# EAGLE design baseboard (EAGLE 6.4)
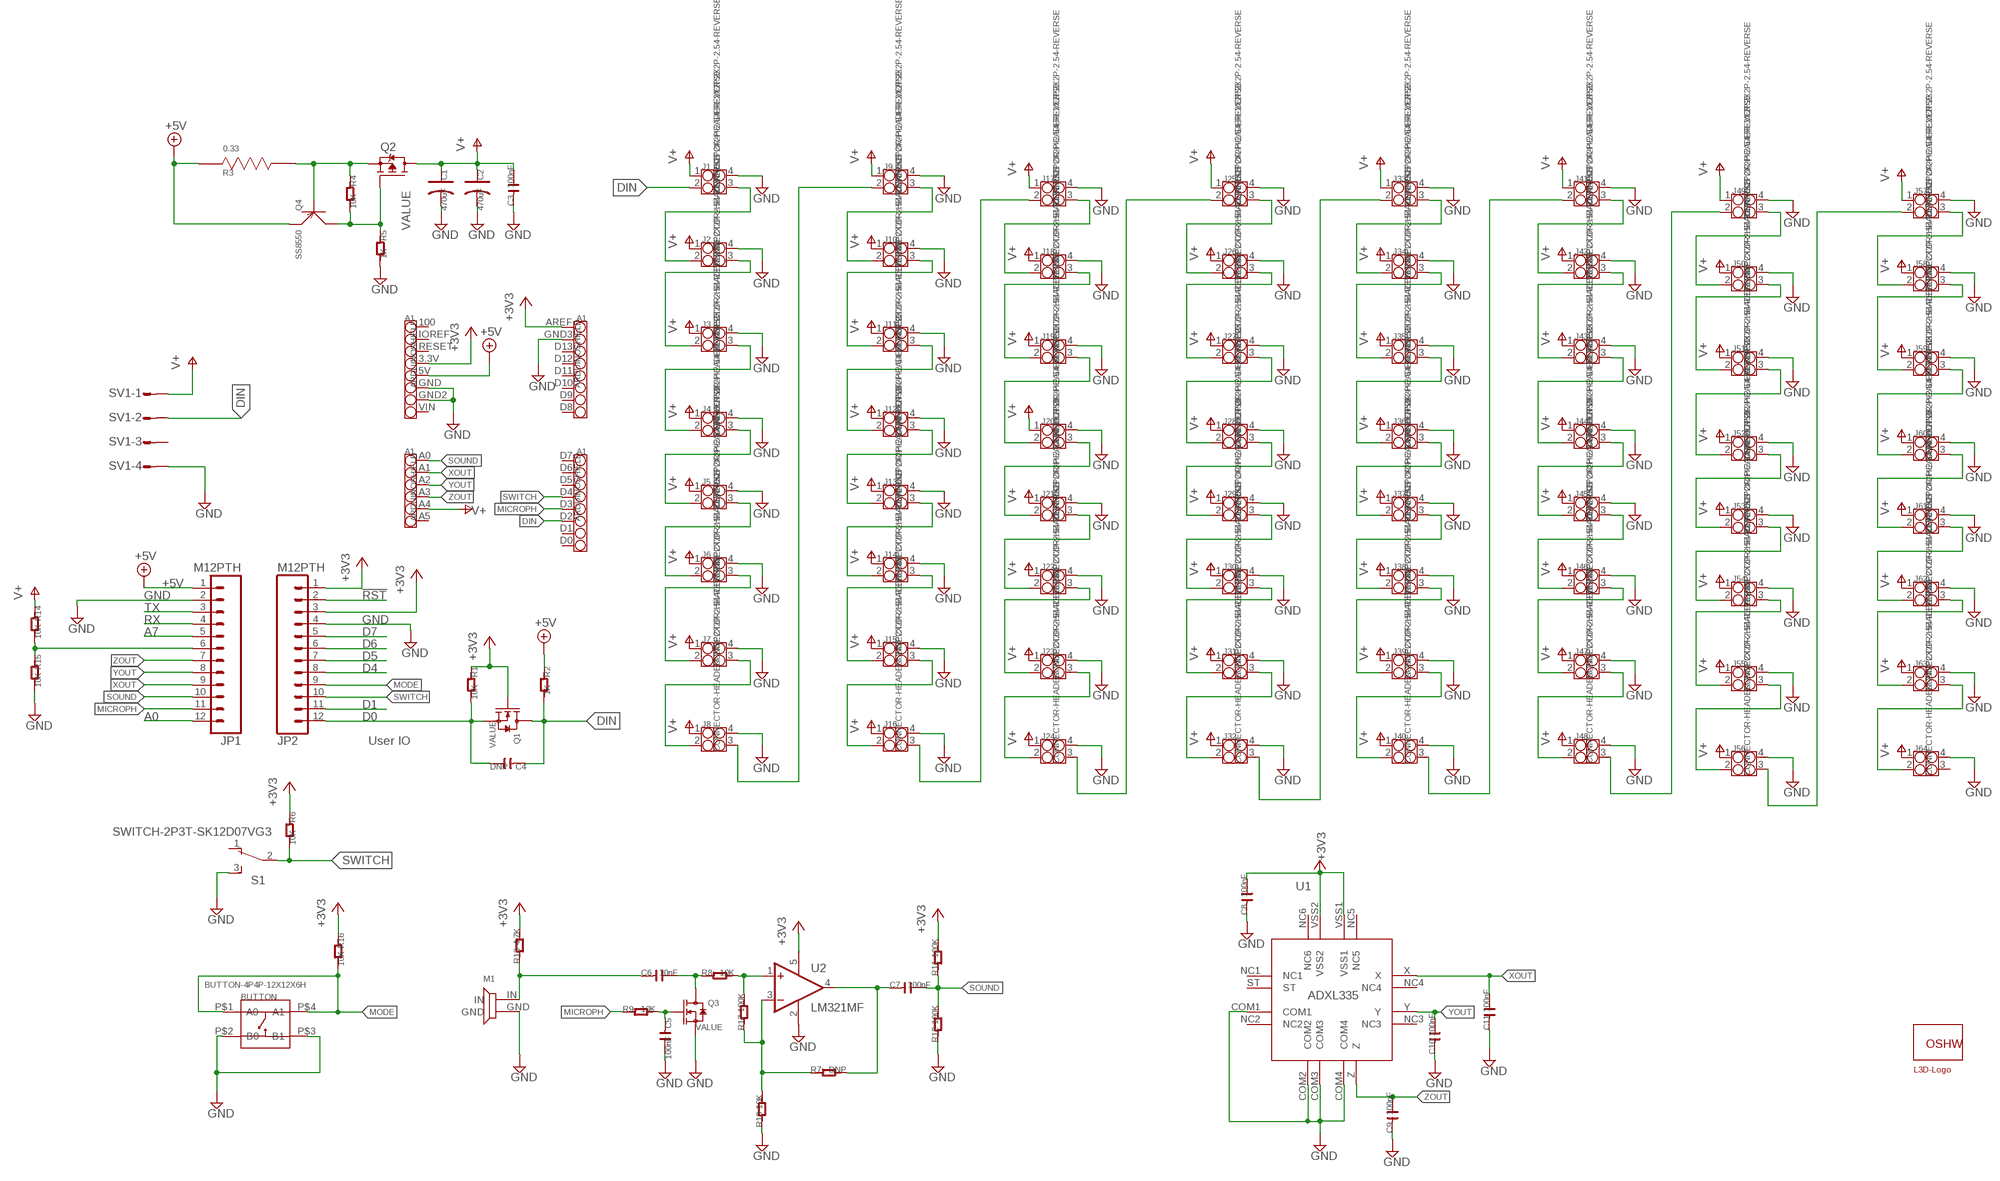
[diagram p0: schematic, sheet 1]

## Parts
A1  ARDUINOSHIELD  [ARDUINOSHIELD]
BUTTON  BUTTON-4P4P-12X12X6H  [4P-12X12X6H]
C1  470uF  C-POLAR  [CAPACITOR-E3-8]
C2  470uF  C-POLAR  [CAPACITOR-E3-8]
C3  100nF  C-0603  [C0603]
C4  DNP  C-0603  [C0603]
C5  100nF  C-0603  [C0603]
C6  10nF  C-0603  [C0603]
C7  100nF  C-0603  [C0603]
C8  100nF  C-0603  [C0603]
C9  100nF  C-0603  [C0603]
C10  100nF  C-0603  [C0603]
C11  100nF  C-0603  [C0603]
GOLD_ORB_SM1  OSHWLOGO_GOLD_ORB_MED  [OSHW1]
J1  CONNECTOR-HEADER-2X2P2X2P-2.54-REVERSE  [2X2P-2.54-REVERSE]
J2  CONNECTOR-HEADER-2X2P2X2P-2.54-REVERSE  [2X2P-2.54-REVERSE]
J3  CONNECTOR-HEADER-2X2P2X2P-2.54-REVERSE  [2X2P-2.54-REVERSE]
J4  CONNECTOR-HEADER-2X2P2X2P-2.54-REVERSE  [2X2P-2.54-REVERSE]
J5  CONNECTOR-HEADER-2X2P2X2P-2.54-REVERSE  [2X2P-2.54-REVERSE]
J6  CONNECTOR-HEADER-2X2P2X2P-2.54-REVERSE  [2X2P-2.54-REVERSE]
J7  CONNECTOR-HEADER-2X2P2X2P-2.54-REVERSE  [2X2P-2.54-REVERSE]
J8  CONNECTOR-HEADER-2X2P2X2P-2.54-REVERSE  [2X2P-2.54-REVERSE]
J9  CONNECTOR-HEADER-2X2P2X2P-2.54-REVERSE  [2X2P-2.54-REVERSE]
J10  CONNECTOR-HEADER-2X2P2X2P-2.54-REVERSE  [2X2P-2.54-REVERSE]
J11  CONNECTOR-HEADER-2X2P2X2P-2.54-REVERSE  [2X2P-2.54-REVERSE]
J12  CONNECTOR-HEADER-2X2P2X2P-2.54-REVERSE  [2X2P-2.54-REVERSE]
J13  CONNECTOR-HEADER-2X2P2X2P-2.54-REVERSE  [2X2P-2.54-REVERSE]
J14  CONNECTOR-HEADER-2X2P2X2P-2.54-REVERSE  [2X2P-2.54-REVERSE]
J15  CONNECTOR-HEADER-2X2P2X2P-2.54-REVERSE  [2X2P-2.54-REVERSE]
J16  CONNECTOR-HEADER-2X2P2X2P-2.54-REVERSE  [2X2P-2.54-REVERSE]
J17  CONNECTOR-HEADER-2X2P2X2P-2.54-REVERSE  [2X2P-2.54-REVERSE]
J18  CONNECTOR-HEADER-2X2P2X2P-2.54-REVERSE  [2X2P-2.54-REVERSE]
J19  CONNECTOR-HEADER-2X2P2X2P-2.54-REVERSE  [2X2P-2.54-REVERSE]
J20  CONNECTOR-HEADER-2X2P2X2P-2.54-REVERSE  [2X2P-2.54-REVERSE]
J21  CONNECTOR-HEADER-2X2P2X2P-2.54-REVERSE  [2X2P-2.54-REVERSE]
J22  CONNECTOR-HEADER-2X2P2X2P-2.54-REVERSE  [2X2P-2.54-REVERSE]
J23  CONNECTOR-HEADER-2X2P2X2P-2.54-REVERSE  [2X2P-2.54-REVERSE]
J24  CONNECTOR-HEADER-2X2P2X2P-2.54-REVERSE  [2X2P-2.54-REVERSE]
J25  CONNECTOR-HEADER-2X2P2X2P-2.54-REVERSE  [2X2P-2.54-REVERSE]
J26  CONNECTOR-HEADER-2X2P2X2P-2.54-REVERSE  [2X2P-2.54-REVERSE]
J27  CONNECTOR-HEADER-2X2P2X2P-2.54-REVERSE  [2X2P-2.54-REVERSE]
J28  CONNECTOR-HEADER-2X2P2X2P-2.54-REVERSE  [2X2P-2.54-REVERSE]
J29  CONNECTOR-HEADER-2X2P2X2P-2.54-REVERSE  [2X2P-2.54-REVERSE]
J30  CONNECTOR-HEADER-2X2P2X2P-2.54-REVERSE  [2X2P-2.54-REVERSE]
J31  CONNECTOR-HEADER-2X2P2X2P-2.54-REVERSE  [2X2P-2.54-REVERSE]
J32  CONNECTOR-HEADER-2X2P2X2P-2.54-REVERSE  [2X2P-2.54-REVERSE]
J33  CONNECTOR-HEADER-2X2P2X2P-2.54-REVERSE  [2X2P-2.54-REVERSE]
J34  CONNECTOR-HEADER-2X2P2X2P-2.54-REVERSE  [2X2P-2.54-REVERSE]
J35  CONNECTOR-HEADER-2X2P2X2P-2.54-REVERSE  [2X2P-2.54-REVERSE]
J36  CONNECTOR-HEADER-2X2P2X2P-2.54-REVERSE  [2X2P-2.54-REVERSE]
J37  CONNECTOR-HEADER-2X2P2X2P-2.54-REVERSE  [2X2P-2.54-REVERSE]
J38  CONNECTOR-HEADER-2X2P2X2P-2.54-REVERSE  [2X2P-2.54-REVERSE]
J39  CONNECTOR-HEADER-2X2P2X2P-2.54-REVERSE  [2X2P-2.54-REVERSE]
J40  CONNECTOR-HEADER-2X2P2X2P-2.54-REVERSE  [2X2P-2.54-REVERSE]
J41  CONNECTOR-HEADER-2X2P2X2P-2.54-REVERSE  [2X2P-2.54-REVERSE]
J42  CONNECTOR-HEADER-2X2P2X2P-2.54-REVERSE  [2X2P-2.54-REVERSE]
J43  CONNECTOR-HEADER-2X2P2X2P-2.54-REVERSE  [2X2P-2.54-REVERSE]
J44  CONNECTOR-HEADER-2X2P2X2P-2.54-REVERSE  [2X2P-2.54-REVERSE]
J45  CONNECTOR-HEADER-2X2P2X2P-2.54-REVERSE  [2X2P-2.54-REVERSE]
J46  CONNECTOR-HEADER-2X2P2X2P-2.54-REVERSE  [2X2P-2.54-REVERSE]
J47  CONNECTOR-HEADER-2X2P2X2P-2.54-REVERSE  [2X2P-2.54-REVERSE]
J48  CONNECTOR-HEADER-2X2P2X2P-2.54-REVERSE  [2X2P-2.54-REVERSE]
J49  CONNECTOR-HEADER-2X2P2X2P-2.54-REVERSE  [2X2P-2.54-REVERSE]
J50  CONNECTOR-HEADER-2X2P2X2P-2.54-REVERSE  [2X2P-2.54-REVERSE]
J51  CONNECTOR-HEADER-2X2P2X2P-2.54-REVERSE  [2X2P-2.54-REVERSE]
J52  CONNECTOR-HEADER-2X2P2X2P-2.54-REVERSE  [2X2P-2.54-REVERSE]
J53  CONNECTOR-HEADER-2X2P2X2P-2.54-REVERSE  [2X2P-2.54-REVERSE]
J54  CONNECTOR-HEADER-2X2P2X2P-2.54-REVERSE  [2X2P-2.54-REVERSE]
J55  CONNECTOR-HEADER-2X2P2X2P-2.54-REVERSE  [2X2P-2.54-REVERSE]
J56  CONNECTOR-HEADER-2X2P2X2P-2.54-REVERSE  [2X2P-2.54-REVERSE]
J57  CONNECTOR-HEADER-2X2P2X2P-2.54-REVERSE  [2X2P-2.54-REVERSE]
J58  CONNECTOR-HEADER-2X2P2X2P-2.54-REVERSE  [2X2P-2.54-REVERSE]
J59  CONNECTOR-HEADER-2X2P2X2P-2.54-REVERSE  [2X2P-2.54-REVERSE]
J60  CONNECTOR-HEADER-2X2P2X2P-2.54-REVERSE  [2X2P-2.54-REVERSE]
J61  CONNECTOR-HEADER-2X2P2X2P-2.54-REVERSE  [2X2P-2.54-REVERSE]
J62  CONNECTOR-HEADER-2X2P2X2P-2.54-REVERSE  [2X2P-2.54-REVERSE]
J63  CONNECTOR-HEADER-2X2P2X2P-2.54-REVERSE  [2X2P-2.54-REVERSE]
J64  CONNECTOR-HEADER-2X2P2X2P-2.54-REVERSE  [2X2P-2.54-REVERSE]
JP1  M12PTH  [1X12-SMALL-PADS]
JP2  M12PTH  [1X12-SMALL-PADS]
M1  MICROPHONE  [MICROPHONE]
Q1  2N7002  MOSFET-N-044020001  [SOT23]
Q2  FDD6637  FDD4141TO252  [TO252]
Q3  2N7002  MOSFET-N-044020001  [SOT23]
Q4  SS8550  TRANSISTOR-PNP-041003001  [SOT23]
R1  10K  R-0603  [R0603]
R2  1K  R-0603  [R0603]
R3  0.33  RESISTOR-3W-20MM  [RESISTOR-3W-20MM]
R4  10K  R-0603  [R0603]
R5  1K  R-0603  [R0603]
R6  10K  R-0603  [R0603]
R7  DNP  R-0603  [R0603]
R8  10K  R-0603  [R0603]
R9  10K  R-0603  [R0603]
R10  10K  R-0603  [R0603]
R11  100K  R-0603  [R0603]
R12  100K  R-0603  [R0603]
R13  4.7K  R-0603  [R0603]
R14  10K  R-0603  [R0603]
R15  10K  R-0603  [R0603]
R16  10K  R-0603  [R0603]
R17  100K  R-0603  [R0603]
S1  SWITCH-2P3T-SK12D07VG3  [SWITCH-2P3T-SK12D07VG3]
SV1  CON-S04P  [S04P]
U1  ADXL335  [ADXL335]
U2  LM321MF  [SOT23-5]
U$1  L3D-LOGOL3DCUBE-LOGO-0.8X2.5  [L3DCUBE-LOGO-0.8X2.5]

## Nets
!RST: JP2.2
+3V3: A1.3.3V A1.AREF C8.2 JP2.1 JP2.3 Q1.1(G) R1.1 R6.1 R11.2 R13.2 R16.1 U1.VSS1 U1.VSS2 U2.5(V+)
+5V: A1.5V JP1.1 Q4.2(E) R2.1 R3.1
A0: JP1.12
A7: JP1.5
D0: C4.2 JP2.12 Q1.2(S) R1.2
D1: JP2.11
D4: JP2.8
D5: JP2.7
D6: JP2.6
D7: JP2.5
DIN: A1.D2 C4.1 J1.2 Q1.3(D) R2.2 SV1.2 SV1.P$2
GND: A1.GND A1.GND2 A1.GND3 BUTTON.P$2(B0) BUTTON.P$3(B1) C1.- C2.- C3.1 C5.2 C8.1 C9.1 C10.1 C11.1 J1.4 J2.4 J3.4 J4.4 J5.4 J6.4 J7.4 J8.4 J9.4 J10.4 J11.4 J12.4 J13.4 J14.4 J15.4 J16.4 J17.4 J18.4 J19.4 J20.4 J21.4 J22.4 J23.4 J24.4 J25.4 J26.4 J27.4 J28.4 J29.4 J30.4 J31.4 J32.4 J33.4 J34.4 J35.4 J36.4 J37.4 J38.4 J39.4 J40.4 J41.4 J42.4 J43.4 J44.4 J45.4 J46.4 J47.4 J48.4 J49.4 J50.4 J51.4 J52.4 J53.4 J54.4 J55.4 J56.4 J57.4 J58.4 J59.4 J60.4 J61.4 J62.4 J63.4 J64.4 JP1.2 JP2.4 M1.GND Q3.2(S) R5.2 R10.1 R12.1 R15.2 S1.3(S) SV1.4 SV1.P$4 U1.COM1 U1.COM2 U1.COM3 U1.COM4 U2.2(V-)
MICROPH: A1.D3 JP1.11 R9.1
MODE: BUTTON.P$1(A0) BUTTON.P$4(A1) JP2.9 R16.2
N$1: J1.3 J2.2
N$2: J2.3 J3.2
N$3: J3.3 J4.2
N$4: J5.3 J6.2
N$5: J6.3 J7.2
N$6: J7.3 J8.2
N$7: J4.3 J5.2
N$8: J9.3 J10.2
N$9: J10.3 J11.2
N$10: J11.3 J12.2
N$11: J13.3 J14.2
N$12: J14.3 J15.2
N$13: J15.3 J16.2
N$14: J12.3 J13.2
N$15: J17.3 J18.2
N$16: J18.3 J19.2
N$17: J19.3 J20.2
N$18: J21.3 J22.2
N$19: J22.3 J23.2
N$20: J23.3 J24.2
N$21: J20.3 J21.2
N$22: J25.3 J26.2
N$23: J26.3 J27.2
N$24: J27.3 J28.2
N$25: J29.3 J30.2
N$26: J30.3 J31.2
N$27: J31.3 J32.2
N$28: J28.3 J29.2
N$29: J8.3 J9.2
N$30: J16.3 J17.2
N$31: J24.3 J25.2
N$32: C7.1 R7.2 U2.4(OUT)
N$33: J33.3 J34.2
N$34: J34.3 J35.2
N$35: J35.3 J36.2
N$36: J37.3 J38.2
N$37: J38.3 J39.2
N$38: J39.3 J40.2
N$39: J36.3 J37.2
N$40: J41.3 J42.2
N$41: J42.3 J43.2
N$42: J43.3 J44.2
N$43: J45.3 J46.2
N$44: J46.3 J47.2
N$45: J47.3 J48.2
N$46: J44.3 J45.2
N$47: J49.3 J50.2
N$48: J50.3 J51.2
N$49: J51.3 J52.2
N$50: J53.3 J54.2
N$51: J54.3 J55.2
N$52: J55.3 J56.2
N$53: J52.3 J53.2
N$54: J57.3 J58.2
N$55: J58.3 J59.2
N$56: J59.3 J60.2
N$57: J61.3 J62.2
N$58: J62.3 J63.2
N$59: J63.3 J64.2
N$60: J60.3 J61.2
N$61: J40.3 J41.2
N$62: J48.3 J49.2
N$63: J56.3 J57.2
N$64: J32.3 J33.2
N$65: Q2.2(S) Q4.1(B) R3.2 R4.1
N$66: R7.1 R10.2 R17.1 U2.3(-IN)
N$67: Q2.1(G) Q4.3(C) R4.2 R5.1
N$68: C5.1 Q3.1(G) R9.2
N$69: R8.2 R17.2 U2.1(+IN)
N$70: C6.2 Q3.3(D) R8.1
N$71: JP1.6 R14.2 R15.1
N$72: C6.1 M1.IN R13.1
RX: JP1.4
SOUND: A1.A0 C7.2 JP1.10 R11.1 R12.2
SWITCH: A1.D4 JP2.10 R6.2 S1.2(P)
TX: JP1.3
V+: A1.A4 C1.+ C2.+ C3.2 J1.1 J2.1 J3.1 J4.1 J5.1 J6.1 J7.1 J8.1 J9.1 J10.1 J11.1 J12.1 J13.1 J14.1 J15.1 J16.1 J17.1 J18.1 J19.1 J20.1 J21.1 J22.1 J23.1 J24.1 J25.1 J26.1 J27.1 J28.1 J29.1 J30.1 J31.1 J32.1 J33.1 J34.1 J35.1 J36.1 J37.1 J38.1 J39.1 J40.1 J41.1 J42.1 J43.1 J44.1 J45.1 J46.1 J47.1 J48.1 J49.1 J50.1 J51.1 J52.1 J53.1 J54.1 J55.1 J56.1 J57.1 J58.1 J59.1 J60.1 J61.1 J62.1 J63.1 J64.1 Q2.3(D) R14.1 SV1.1 SV1.P$1
XOUT: A1.A1 C11.2 JP1.9 U1.X
YOUT: A1.A2 C10.2 JP1.8 U1.Y
ZOUT: A1.A3 C9.2 JP1.7 U1.Z
Unconnected: A1.100 A1.A5 A1.D0 A1.D1 A1.D5 A1.D6 A1.D7 A1.D8 A1.D9 A1.D10 A1.D11 A1.D12 A1.D13 A1.IOREF A1.RESET A1.VIN J64.3 S1.1(O) SV1.3 SV1.P$3 U1.NC1 U1.NC2 U1.NC3 U1.NC4 U1.NC5 U1.NC6 U1.ST

## Notes on the sheet
- User IO

## Library data of the parts
A1 = OPL Eagle Library:ARDUINOSHIELD
BUTTON = OPL Eagle Library:BUTTON-4P
C1 C2 = OPL Eagle Library:C-POLAR*
C3-C11 = OPL Eagle Library:C*
GOLD_ORB_SM1 = NBitWonder:OSHWLOGO: These are Open-Source Hardware logos.
J1-J64 = OPL Eagle Library:CONNECTOR-HEADER-2X2P
JP1 JP2 = Spark:M12: Header 12 Standard 12-pin 0.1" header. Use with straight break away headers (SKU : PRT-00116), right angle break away headers (PRT-00553), swiss pins (PRT-00743), machine pins (PRT-00117), and female headers (PRT-00115).
M1 = OPL Eagle Library:MICROPHONE
Q1 Q3 = OPL Eagle Library:MOSFET-N: CJ2302：SMD MOSFET N-CH 20V-2.1A
Q2 = transistor-fet:FDD4141: P-Channel PowerTrench® MOSFET Source: FDD4141.pdf
Q4 = OPL Eagle Library:TRANSISTOR-PNP*: S8550：PNP Transistor
R1 R2 R4-R17 = OPL Eagle Library:R*
R3 = OPL Eagle Library:RESISTOR-3W-20MM
S1 = OPL Eagle Library:SWITCH-2P3T-SK12D07VG3: TINY SWITCH ON - ON Source: http://www2.produktinfo.conrad.com/datenblaetter/700000-724999/705152-da-01-de-Subminiaturschalter_TL_36YO.pdf
SV1 = OPL Eagle Library:CON-S04P: AMP MT CONNECTOR; OC_FARNELL: unknown; OC_NEWARK: unknown
U1 = OPL Eagle Library:ADXL335
U2 = linear:LM321?*: Low Power Single Op Amp Source: http://cache.national.com/ds/LM/LM321.pdf
U$1 = OPL Eagle Library:L3D-LOGO

## Board
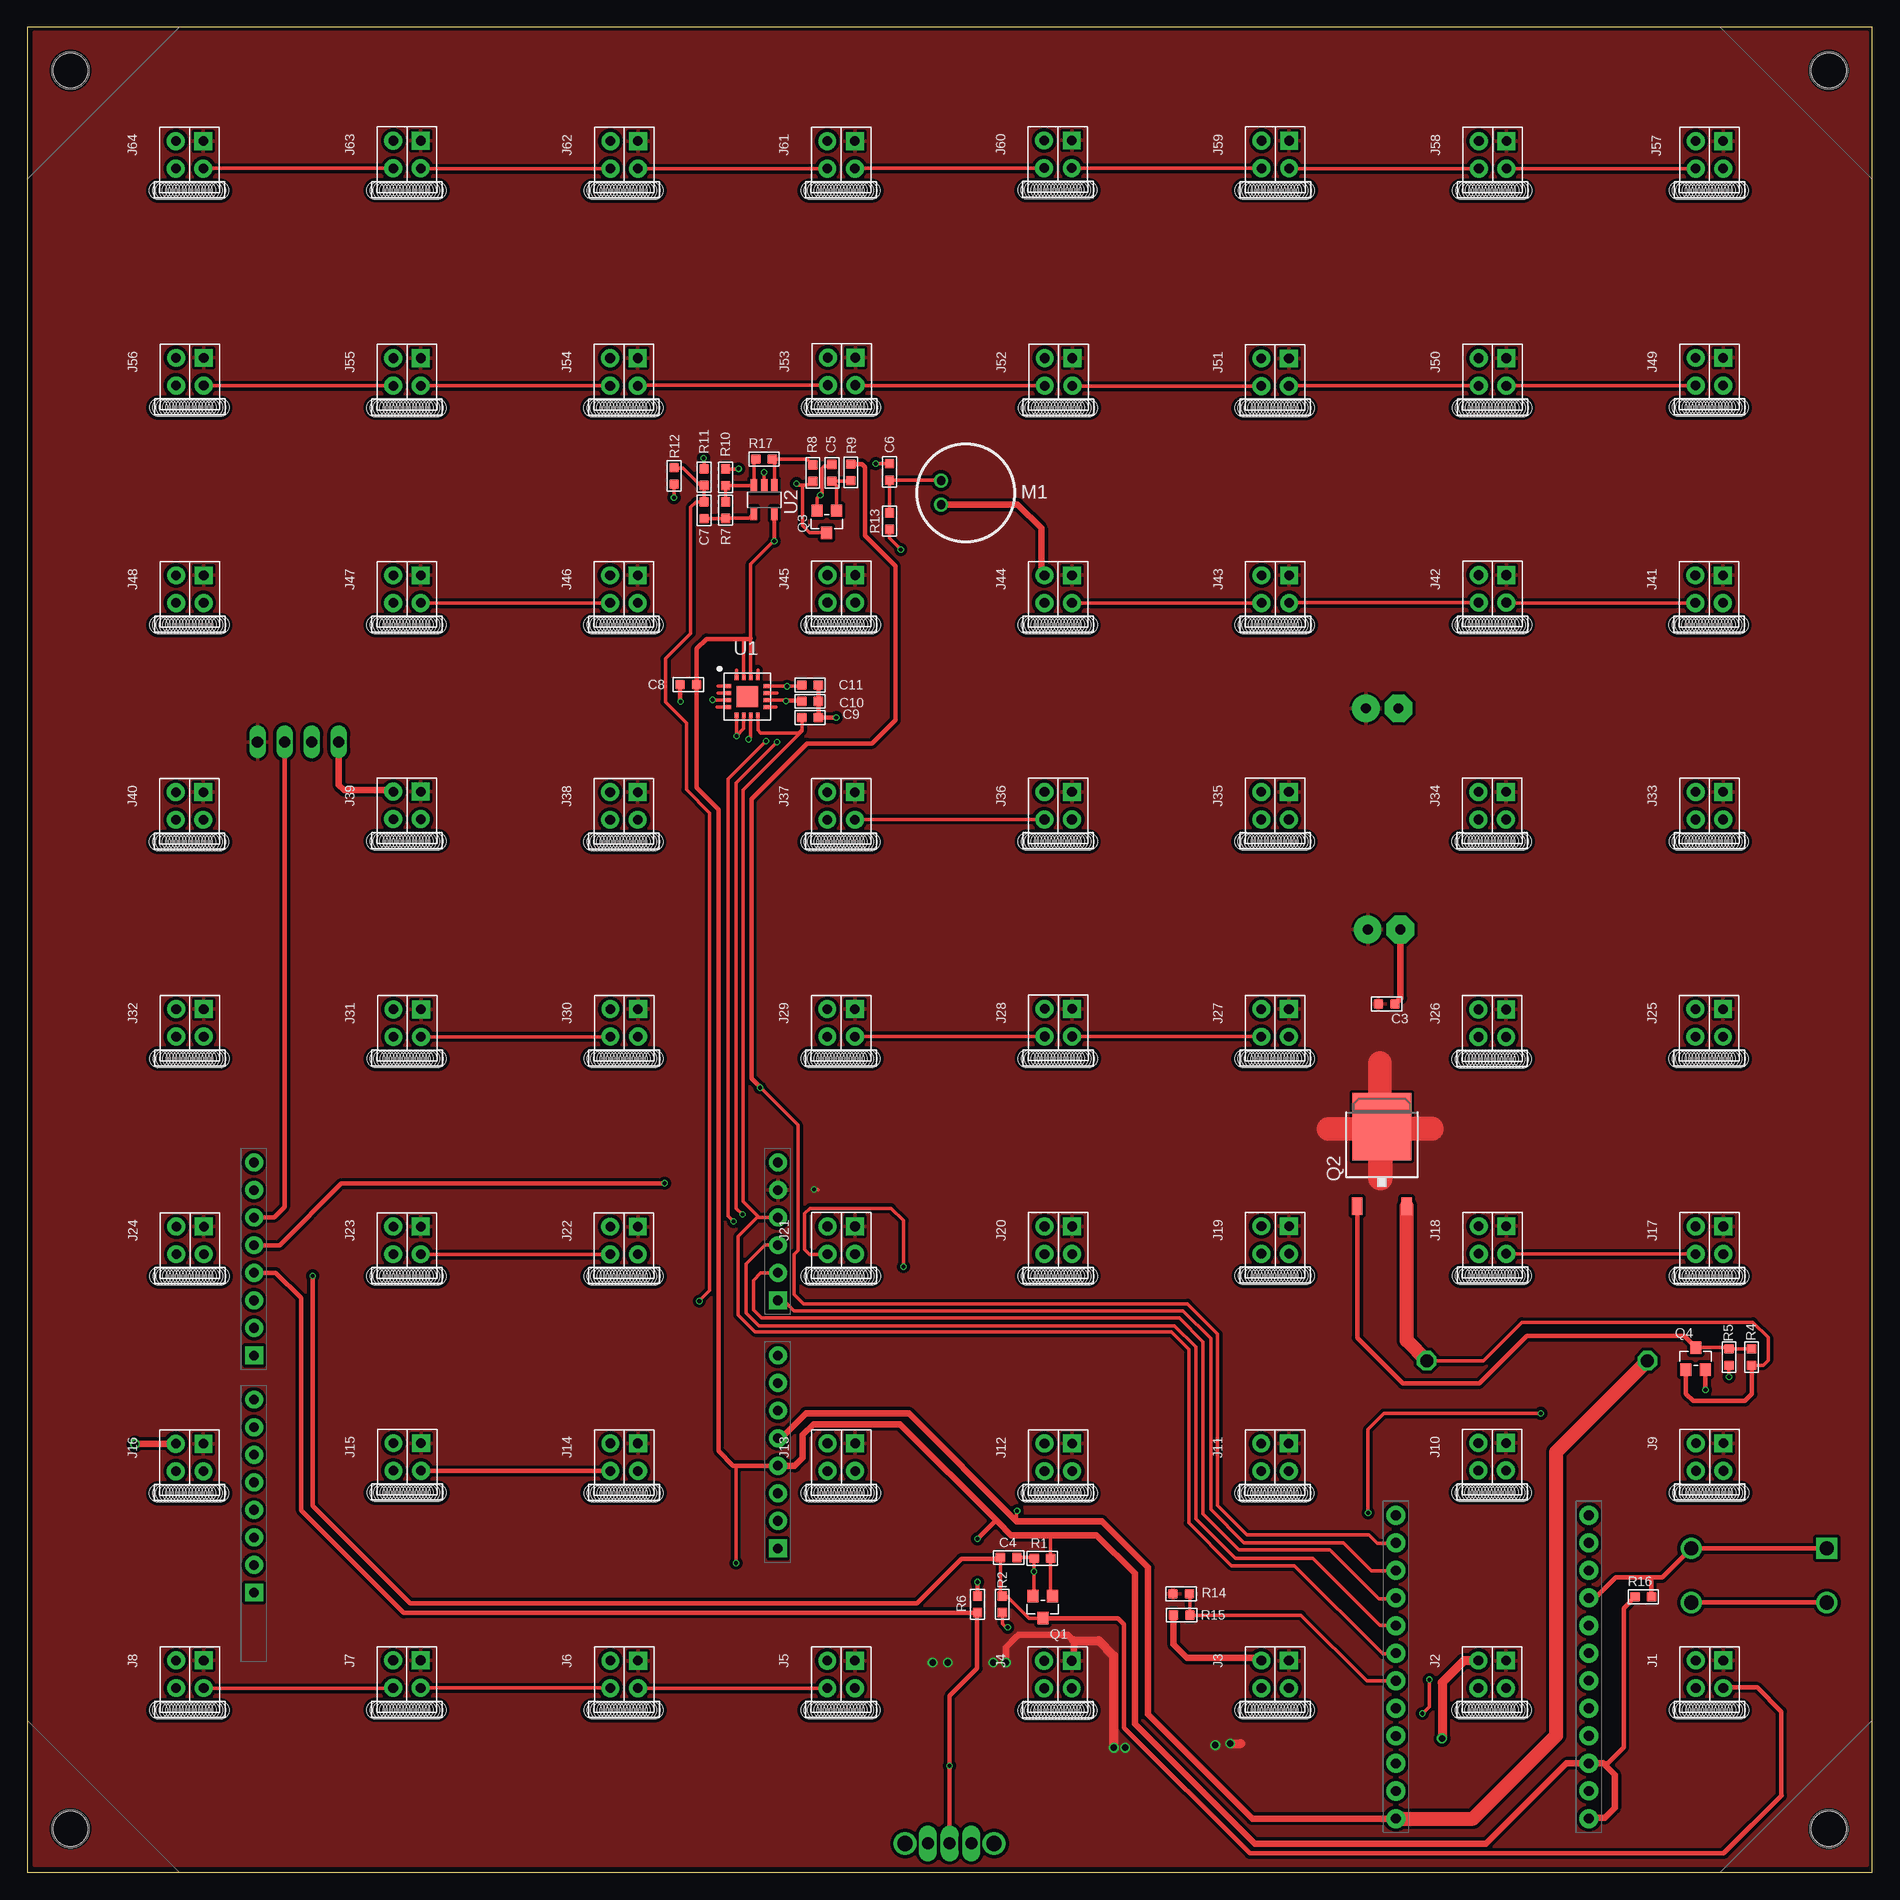
[diagram p1: board, top side]
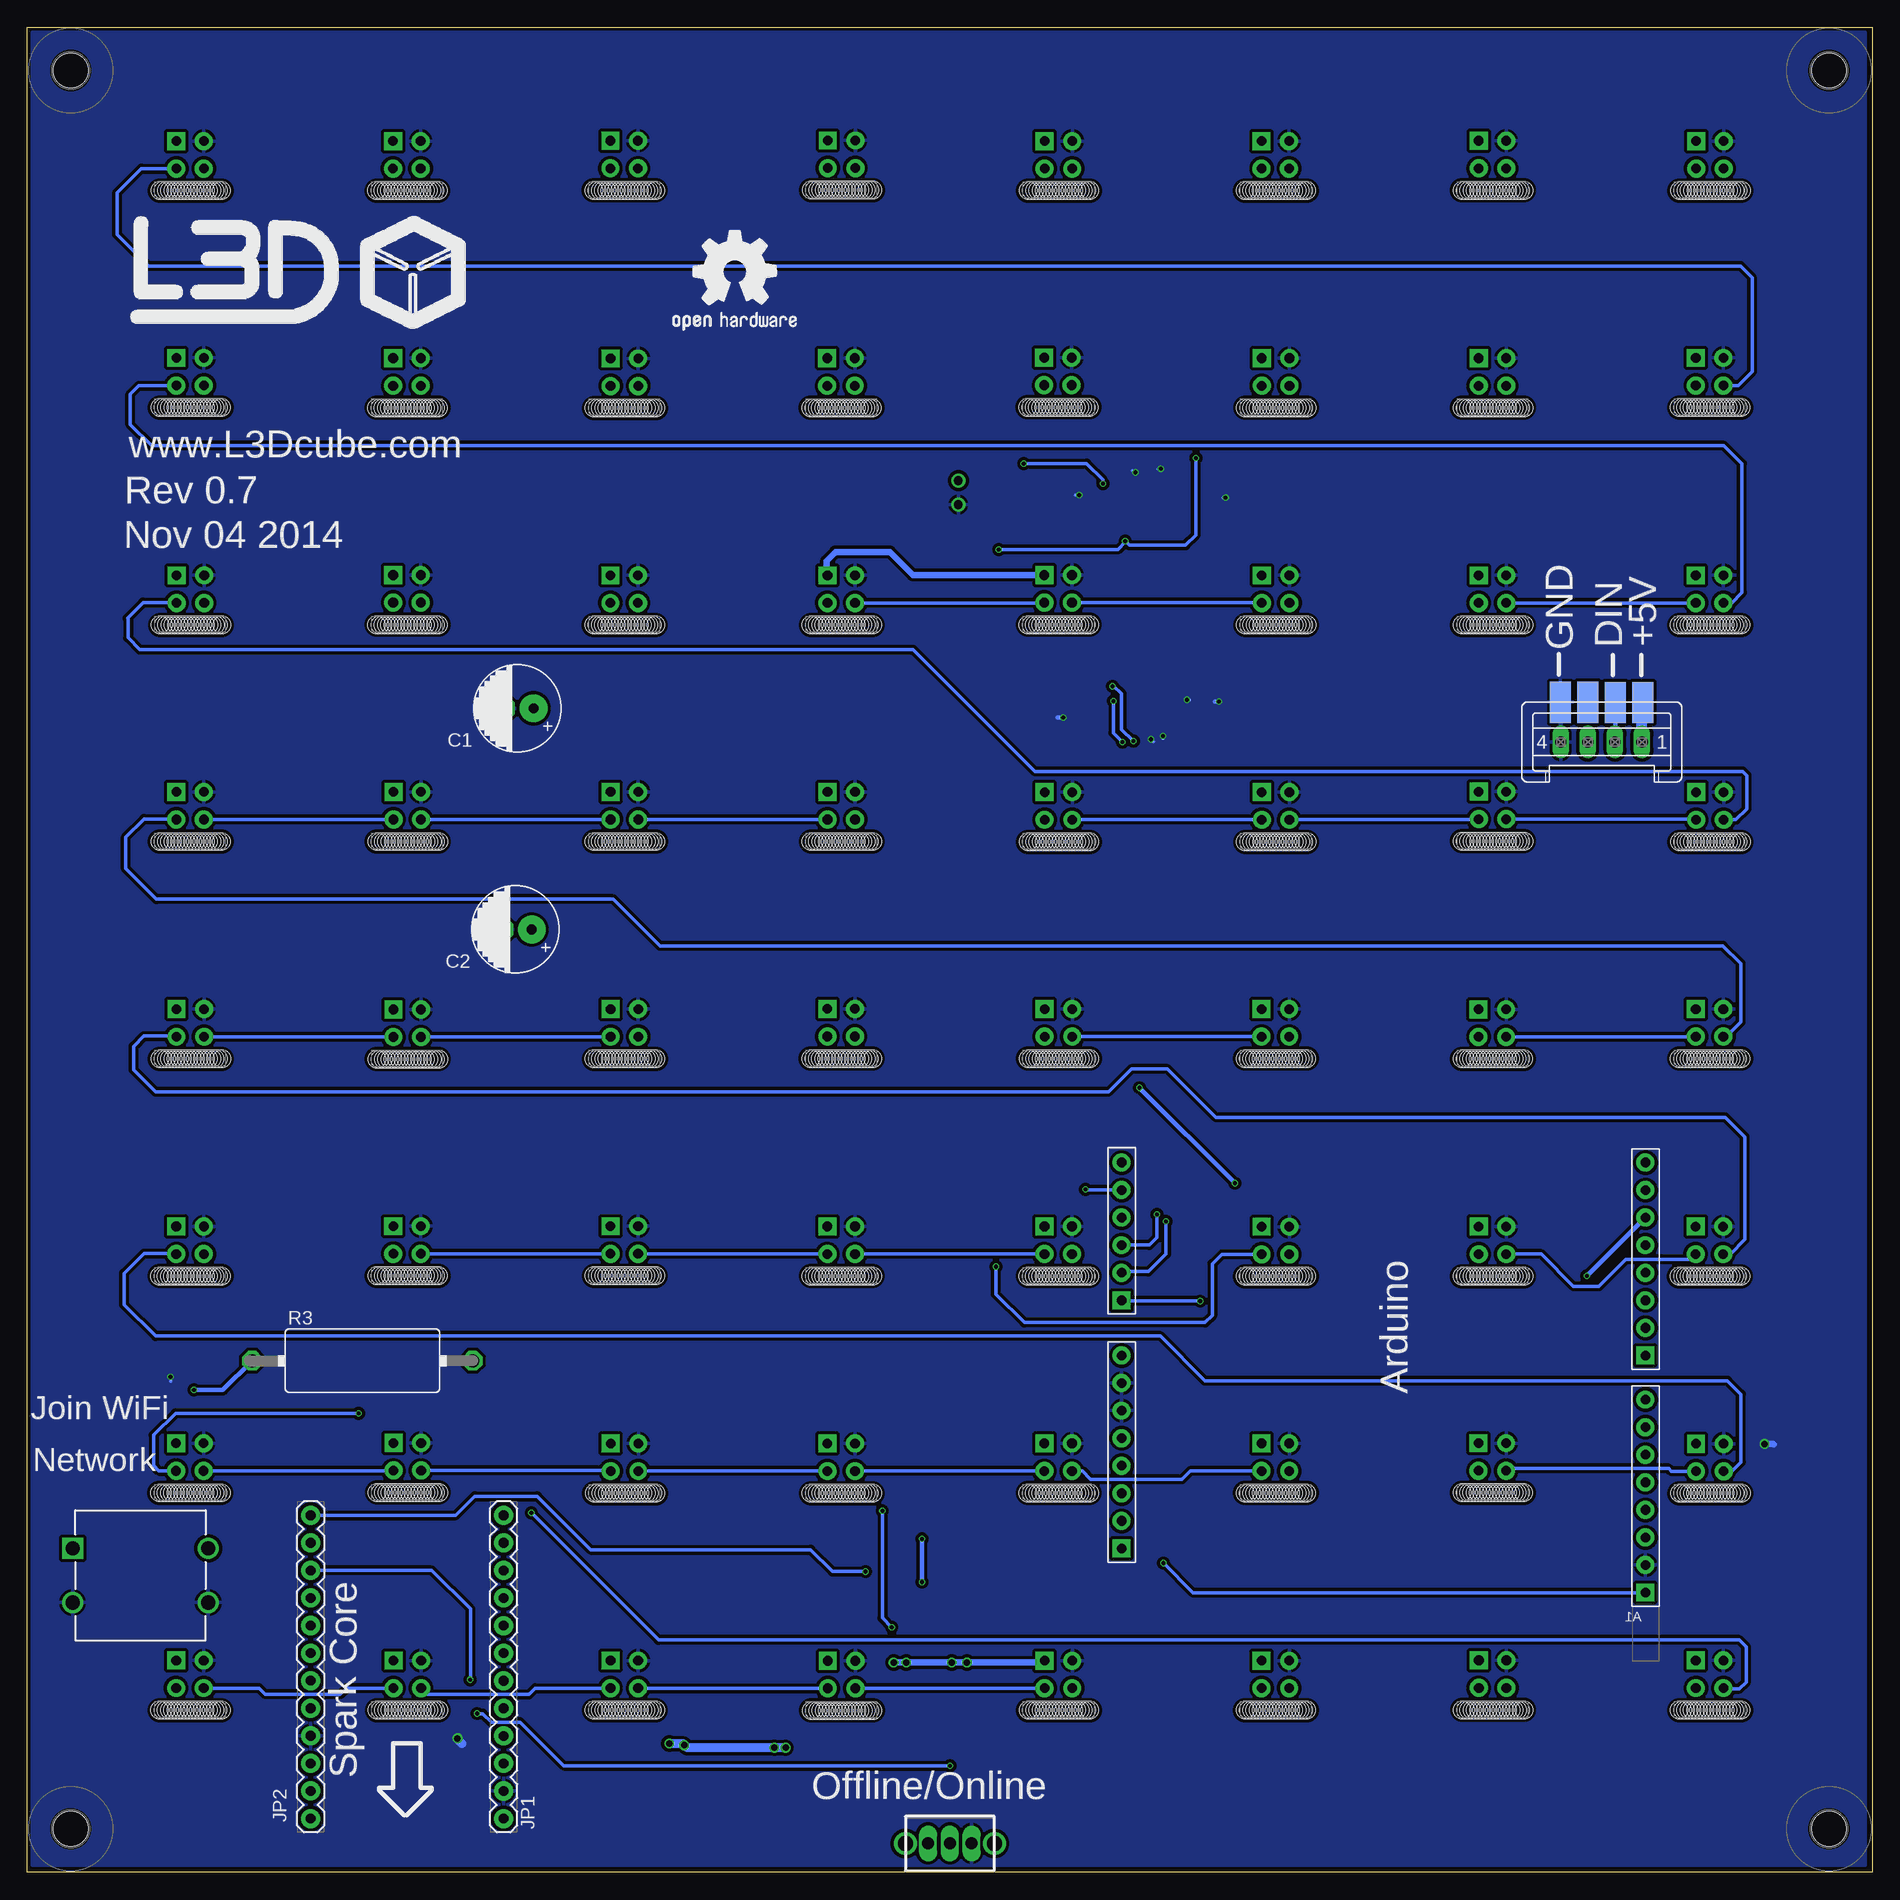
[diagram p2: board, bottom side, seen from below]

Size 170 x 170 mm. Coordinates in mm from the lower left corner, seen from the top.
Outline: 170,170 0,170 0,0 170,0 170,170
Copper layers (1*16): Top 0.035mm / dielectric 0.5mm / Bottom 0.035mm
Design rules "default *": minimum track width 10mil, minimum drill 15mil, track to track 8mil, track to pad 0mil, pad to pad 0mil, via to via 0mil, smd to smd 8mil, copper to edge 0mil, drill to drill 0mil, minimum pad ring 10mil, minimum via ring 0mil, stop-mask expansion 4mil, vias tented up to drill 0mil, thermal gap 10mil
Holes 3.2 mm at 3.99,166.01 165.99,166.01 165.99,4.01 3.99,4.01

### Footprints (pad centres in the part's own frame; a part is rotated, then mirrored left to right if it is on the bottom)
ARDUINOSHIELD = drill 0.889 pad 1.651: 3.3V 35.56,2.54; 5V 38.1,2.54; A1 53.34,2.54; A2 55.88,2.54; A3 58.42,2.54; A4 60.96,2.54; A5 63.5,2.54; D0 63.5,50.8; D1 60.96,50.8; D2 58.42,50.8; D3 55.88,50.8; D4 53.34,50.8; D5 50.8,50.8; D6 48.26,50.8; D8 41.656,50.8; D9 39.116,50.8; D10 36.576,50.8; D11 34.036,50.8; D12 31.496,50.8; D13 28.956,50.8; GND 40.64,2.54; GND2 43.18,2.54; GND3 26.416,50.8; IOREF 30.48,2.54; RESET 33.02,2.54; VIN 45.72,2.54 | drill 0.889 pad 1.651 square: 100 27.94,2.54; A0 50.8,2.54; AREF 23.876,50.8; D7 45.72,50.8
4P-12X12X6H = drill 1.3 square: P$1 -6.25,2.5 | drill 1.3: P$2 -6.25,-2.5; P$3 6.25,-2.5; P$4 6.25,2.5
CAPACITOR-E3-8 = drill 0.9 pad 2.54: + -1.5,0 | drill 0.9 pad 2.54 octagon: - 1.5,0
C0603 = smd 0.889 x 0.889: 1 -0.762,0; 2 0.762,0
2X2P-2.54-REVERSE = drill 0.889 pad 1.651 square: 1 -1.27,-1.27 | drill 0.889 pad 1.651: 2 -1.27,1.27; 3 1.27,1.27; 4 1.27,-1.27 | hole 1.6: -2.8,3.3; -2.5,3.3; -2.2,3.3; -1.9,3.3; -1.6,3.3; -1.3,3.3; -1,3.3; -0.7,3.3; -0.4,3.3; -0.1,3.3; 0.2,3.3; 0.5,3.3; 0.8,3.3; 1.1,3.3; 1.4,3.3; 1.7,3.3; 2,3.3; 2.3,3.3; 2.6,3.3; 2.9,3.3
1X12-SMALL-PADS = drill 0.889 pad 1.753: 1 0,0; 2 2.54,0; 3 5.08,0; 4 7.62,0; 5 10.16,0; 6 12.7,0; 7 15.24,0; 8 17.78,0; 9 20.32,0; 10 22.86,0; 11 25.4,0; 12 27.94,0
MICROPHONE = drill 0.8: GND 0,-1.1; IN 0,1.1
SOT23 = smd 1.016 x 1.143: 1 -0.889,-1.016; 2 0.889,-1.016; 3 0,1.016
TO252 = smd 1 x 1.6: 1 -2.28,-4.8; 2 2.28,-4.8 | smd 5.4 x 6.2: 3 0,2.5
R0603 = smd 0.889 x 0.889: 1 -0.762,0; 2 0.762,0
RESISTOR-3W-20MM = drill 1.194 octagon: 1 -10.16,0; 2 10.16,0
SWITCH-2P3T-SK12D07VG3 = drill 1.1 pad 1.422 long: 1 -2,0; 2 0,0; 3 2,0 | drill 1.4 pad 1.93: M1 -4.1,0; M2 4.1,0
S04P = drill 1.016 long: 1 3.75,0; 2 1.25,0; 3 -1.25,0; 4 -3.75,0 | smd 1.93 x 3.81: P$1 3.81,3.632; P$2 1.27,3.632; P$3 -1.245,3.658; P$4 -3.759,3.658
ADXL335 = smd 0.5 x 0.35: COM1 -1.75,-0.325; NC1 -1.75,0.975; NC2 -1.75,-0.975; NC3 1.75,-0.975; NC4 1.75,0.325; ST -1.75,0.325; X 1.75,0.975; Y 1.75,-0.325 | smd 0.35 x 0.5: COM2 -0.975,-1.75; COM3 -0.325,-1.75; COM4 0.325,-1.75; NC5 0.975,1.75; NC6 -0.975,1.75; VSS1 0.325,1.75; VSS2 -0.325,1.75; Z 0.975,-1.75 | smd 1.95 x 1.95: P$17 0,0
SOT23-5 = smd 0.6 x 1.2: 1 -0.95,-1.306; 2 0,-1.306; 3 0.95,-1.306; 4 0.95,1.306; 5 -0.95,1.306

### Placement (x,y rotation side)
A1  71.71,1.9 90 top
BUTTON  159.56,27.36 0 bottom
C1  124.84,107.24 180 bottom
C2  125.02,86.87 180 bottom
C3  125.25,80.01 180 top
C4  90.42,29.01 0 top
C5  74.14,128.95 90 top
C6  79.46,129.02 90 top
C7  62.37,125.49 90 top
C8  60.91,109.42 0 top
C9  72.14,106.4 180 top
C10  72.14,107.9 180 top
C11  72.14,109.4 180 top
GOLD_ORB_SM1  111.18,140.34 0 bottom
J1  155,18.25 180 top
J2  134.98,18.24 180 top
J3  114.98,18.24 180 top
J4  94.97,18.23 180 top
J5  74.99,18.24 180 top
J6  55,18.24 180 top
J7  34.99,18.26 180 top
J8  14.99,18.25 180 top
J9  155.01,38.26 180 top
J10  134.98,38.29 180 top
J11  114.96,38.24 180 top
J12  95,38.24 180 top
J13  75.01,38.25 180 top
J14  55,38.25 180 top
J15  35.01,38.27 180 top
J16  14.97,38.22 180 top
J17  154.99,58.24 180 top
J18  135,58.27 180 top
J19  114.99,58.27 180 top
J20  95,58.24 180 top
J21  75.01,58.24 180 top
J22  55,58.21 180 top
J23  35,58.23 180 top
J24  15.01,58.22 180 top
J25  154.97,78.26 180 top
J26  134.99,78.23 180 top
J27  114.97,78.26 180 top
J28  95.01,78.28 180 top
J29  74.99,78.27 180 top
J30  55,78.27 180 top
J31  35.01,78.24 180 top
J32  15,78.27 180 top
J33  154.99,98.27 180 top
J34  134.98,98.27 180 top
J35  114.98,98.27 180 top
J36  94.99,98.27 180 top
J37  74.99,98.25 180 top
J38  54.98,98.25 180 top
J39  35,98.3 180 top
J40  14.97,98.25 180 top
J41  154.96,118.23 180 top
J42  135.01,118.25 180 top
J43  115,118.23 180 top
J44  94.99,118.23 180 top
J45  75.01,118.25 180 top
J46  54.98,118.23 180 top
J47  35,118.23 180 top
J48  14.99,118.23 180 top
J49  154.99,138.26 180 top
J50  135.01,138.23 180 top
J51  114.98,138.21 180 top
J52  95.02,138.23 180 top
J53  75.04,138.29 180 top
J54  54.98,138.23 180 top
J55  35,138.23 180 top
J56  14.99,138.26 180 top
J57  154.99,158.24 180 top
J58  135.02,158.24 180 top
J59  115,158.27 180 top
J60  94.97,158.29 180 top
J61  74.99,158.24 180 top
J62  55.01,158.24 180 top
J63  35,158.27 180 top
J64  14.97,158.24 180 top
JP1  126.11,4.95 90 top
JP2  143.88,4.96 90 top
M1  84.21,127.11 0 top
Q1  93.57,24.43 180 top
Q2  124.82,66.19 0 top
Q3  73.67,124.44 180 top
Q4  153.72,47.35 0 top
R1  93.54,28.94 180 top
R2  89.85,24.7 90 top
R3  139.12,47.14 0 bottom
R4  158.88,47.47 90 top
R5  156.79,47.47 270 top
R6  87.55,24.69 270 top
R7  64.35,125.51 270 top
R8  72.38,128.92 90 top
R9  75.88,128.99 270 top
R10  64.34,128.53 270 top
R11  62.37,128.54 90 top
R12  59.6,128.67 90 top
R13  79.45,124.49 270 top
R14  106.32,25.65 0 top
R15  106.38,23.7 180 top
R16  148.89,25.37 0 top
R17  67.89,130.2 0 top
S1  84.99,2.67 0 bottom
SV1  24.97,104.14 0 bottom
U1  66.34,108.33 0 top
U2  67.89,126.47 180 top
U$1  147.17,148.44 0 bottom

### Tracks (layer width: path | path; a pad name or v marks a point on that pad's centre or on a via)
+3V3  (via drill 0.38)
  Top 0.305: U1.VSS1 66.67,113.72 66.67,120.54 68.86,122.73 68.86,125.15 U2.5 v68.83,122.66 | Q1.1 94.3,25.61 R1.1 94.3,30.95 94.41,31.06 | U1.VSS2 66.02,113.57 66.09,113.64 | v65.3,28.5 65.3,37.41 65.25,37.46 | v80.49,121.87 79.45,122.91 R13.2 | v62.33,130.3 62.37,130.27 R11.2
  Top 0.406: A1.3.3V 65.25,37.46 65.05,37.46 63.7,38.81 63.7,97.92 61.67,99.95 C8.2 61.67,112.72 62.59,113.64 66.09,113.64 66.59,113.64 66.67,113.72 | 145.21,10.04 145.62,10.04 147.09,11.51 147.09,24.33 R16.1 | R6.1 v87.55,26.75 | v87.55,30.73 89.1,32.28 89.43,32.28
  Top 0.61: JP2.1 143.95,5.03 145.34,5.03 146.25,5.94 146.25,8.99 145.21,10.04 JP2.3 141.81,10.04 134.39,2.62 113.11,2.62 102.06,13.66 102.06,27.53 98.53,31.06 94.41,31.06 90.65,31.06 89.43,32.28 80.44,41.27 72.44,41.27 71.45,40.28 71.45,38.18 70.71,37.44 69.19,37.44 A1.3.3V
  Bottom 0.305: A1.AREF 62.58,25.78 v65.3,28.5 | v80.49,121.87 69.52,121.87 68.8,122.59 68.8,122.67 | v68.83,122.66 68.45,122.28 63.27,122.28 62.33,123.22 v62.33,130.3
  Bottom 0.406: v87.55,26.75 v87.55,30.73 | v68.83,122.66 68.81,122.66 68.8,122.67
+5V  (via drill 0.38)
  Top 0.305: 91.16,32.36 91.16,33.25 v91.21,33.3 | v90.35,22.58 90.19,22.58 89.86,22.91 89.86,23.92 R2.1
  Top 0.406: Q4.2 154.61,44.48 v154.63,44.45
  Top 0.61: JP1.1 112.88,4.95 103.28,14.55 103.28,28.09 99.01,32.36 91.16,32.36 81.23,42.29 71.75,42.29 69.72,40.26 69.42,40.26 A1.5V 69.37,40.21
  Top 1.27: JP1.1 133.2,4.95 140.87,12.62 140.87,38.73 R3.1
  Bottom 0.305: v91.21,33.3 91.21,23.44 v90.35,22.58
  Bottom 0.406: v154.63,44.45 151.97,44.45 R3.1
D0  (via drill 0.38)
  Top 0.305: C4.2 92.71,29.01 R1.2 v92.77,27.71 92.77,25.54 Q1.2
  Bottom 0.305: v92.77,27.71 95.81,27.71 97.81,29.72 118.08,29.72 123.01,34.65 128.75,34.65 130.5,32.89 JP2.12
DIN  (via drill 0.38)
  Top 0.305: C4.1 89.66,25.65 R2.2 90.23,25.46 92.28,23.42 Q1.3
  Top 0.406: SV1.2 23.72,61.31 22.76,60.35 20.94,60.35 A1.D2 | Q1.3 100.51,23.42 101.07,22.86 101.07,13.34 112.65,1.75 156.29,1.75 | 156.29,1.75 161.65,7.11 | 156.29,16.97 J1.2 156.33,17.04 159.38,17.04 161.62,14.81 161.62,7.04 156.34,1.75 156.29,1.75 | C4.1 89.56,28.91 86.08,28.91 81.97,24.79 35.28,24.79 26.31,33.76 v26.31,54.94
  Bottom 0.406: SV1.P$2 23.7,104.16 SV1.2 | v26.31,54.94 20.93,60.32 A1.D2
GND  (via drill 0.38, 0.6)
  Top 0.305: U1.COM2 65.37,104.71 v65.35,104.7 66.02,105.36 U1.COM3 | U1.COM4 66.67,104.59 v66.47,104.39 | U1.COM1 63.16,108.01 v63.14,108.03 | Q3.2 72.78,126.6 72.81,126.6 v73.08,126.87 73.25,127.05 73.25,129.36 73.41,129.54 73.97,129.54 C5.2 | U2.2 v67.89,128.98 | v67.89,128.98 | R10.1 65.54,129.29 v65.56,129.31 | R12.1 59.6,126.66 v59.59,126.64 | R5.2 v156.79,45.64
  Top 0.406: C11.1 C10.1 C9.1 v74.55,106.4 | BUTTON.P$3 BUTTON.P$2 | C8.1 60.15,107.92 v60.2,107.87
  Top 0.61: SV1.4 28.72,100.19 29.21,99.69 33.6,99.69 J39.4 | M1.GND 91.26,126.01 93.45,123.83 93.45,119.78 J44.4 | C3.1 126.52,80.52 C2.- | R15.2 105.61,21.01 106.86,19.76 113.46,19.76 J3.4 | J16.4 9.95,39.49 v9.93,39.47
  Top 0.813: J2.4 132.39,19.51 130.38,17.5 130.38,12.37 v130.35,12.34
  Bottom 0.305: v65.35,104.7 65.35,104.47 | v66.47,104.39 66.24,104.17 | v63.14,108.03 62.92,108.03 | v67.89,128.98 68.02,128.98 68.17,129.13 | v73.08,126.87 73.41,126.87 | v65.56,129.31 65.76,129.31 65.81,129.26 | v59.59,126.64 59.82,126.64 59.84,126.67 | v156.79,45.64 156.79,45.24
  Bottom 0.406: v60.2,107.87 60.55,107.87 60.58,107.85 | v74.55,106.4 75.06,106.4
  Bottom 0.61: v9.93,39.47 9.12,39.47 9.07,39.42
  Bottom 0.813: v130.35,12.34 130.35,12.27 129.95,11.86
  pour Bottom (isolate 0.305): 0.64,169.54 169.54,169.54 169.54,0.64 0.64,0.64 0.64,19.05
MICROPH  (via drill 0.38)
  Top 0.305: v67.51,72.29 67.61,72.29 67.61,72.26 71.02,68.86 71.02,57.3 70.66,56.95 70.66,53.24 71.53,52.38 106.91,52.38 109.68,49.61 109.68,33.81 112.39,31.09 123.6,31.09 124.38,30.3 126.06,30.3 JP1.11
  Top 0.406: A1.D3 23.26,57.78 28.93,63.45 58.7,63.45 v58.73,63.5 | v67.51,72.29 67.51,72.34 66.73,73.13 66.73,98.88 71.86,104.01 77.85,104.01 79.98,106.15 79.98,120.34 77.19,123.14 77.19,129.46 76.91,129.74 R9.1
  Bottom 0.406: v58.73,63.5 v67.51,72.29
MODE
  Top 0.406: JP2.9 144.48,25.28 146.38,27.18 149.45,27.18 | 149.45,27.18 150.63,27.18 BUTTON.P$4 BUTTON.P$1 | R16.2 149.66,26.98 149.45,27.18
N$1
  Bottom 0.305: J2.2 140.58,16.97 141.15,16.41 148.08,16.41 148.64,16.97 153.72,16.97 J1.3
N$2
  Top 0.305: J3.2
  Bottom 0.305: J2.3 133.12,16.38 123.77,16.38 123.19,16.97 J3.2
N$3
  Bottom 0.305: J3.3 96.25,16.97 J4.2
N$4
  Top 0.305: J6.2 J5.3
N$5
  Top 0.305: J7.2 53.7,16.99 J6.3
N$6
  Top 0.305: J8.2 33.7,16.98 J7.3
N$7
  Bottom 0.305: J5.2 93.69,16.97 J4.3
N$8
  Bottom 0.305: J10.2 136.27,36.99 J9.3
N$9
  Bottom 0.305: J11.2 116.28,37.02 J10.3
N$10
  Bottom 0.305: J12.2 J11.3
N$11
  Bottom 0.305: J14.2 62.84,36.98 63.6,36.22 72.03,36.22 72.79,36.98 J13.3
N$12
  Top 0.406: J15.2 53.7,37.01 J14.3
N$13
  Bottom 0.305: J16.2 18.51,36.95 18.77,37.21 33.53,37.21 J15.3
N$14
  Bottom 0.305: J13.2 76.29,36.97 J12.3
N$15
  Top 0.305: J18.2 136.3,56.97 J17.3
N$16
  Bottom 0.305: J19.2 J18.3
N$17
  Bottom 0.305: J20.2 96.29,56.99 J19.3
N$18  (via drill 0.38)
  Top 0.305: v80.75,55.8 80.75,60.05 79.6,61.19 72.11,61.19 71.63,60.71 71.63,57.4 72.08,56.95 73.72,56.95 J21.3
  Bottom 0.305: J22.2 59.92,56.95 60.81,56.06 60.81,51.31 61.47,50.65 78.13,50.65 80.75,53.26 v80.75,55.8
N$19
  Top 0.305: J23.2 36.28,56.95 J22.3
N$20
  Bottom 0.305: J24.2 16.75,56.49 22.71,56.49 25.2,54 27.53,54 30.49,56.96 J23.3
N$21
  Bottom 0.305: J21.2 J20.3
N$22
  Bottom 0.305: J26.2 136.28,76.99 J25.3
N$23
  Bottom 0.305: J27.2 116.27,76.96 J26.3
N$24
  Top 0.305: J27.3 113.68,77.01 J28.2
  Bottom 0.305: J28.2 96.31,76.99
N$25
  Bottom 0.305: J30.2 J29.3
N$26
  Top 0.305: J30.3 53.71,76.97 J31.2
  Bottom 0.305: J31.2 36.3,77
N$27
  Bottom 0.305: J32.2 16.29,76.97 J31.3
N$28
  Top 0.305: J28.3 93.72,77 J29.2
  Bottom 0.305: J29.2 76.27,77.01
N$29  (via drill 0.38)
  Top 0.305: v123.55,33.12 123.55,40.82 124.99,42.27 139.45,42.27 v139.47,42.29
  Bottom 0.305: J8.3 13.66,16.92 12.24,16.92 11.63,17.53 11.63,20.78 12.27,21.41 111.84,21.41 v123.55,33.12 | v139.47,42.29 156.34,42.29 158.34,40.28 158.34,37.49 157.86,37.01 156.3,37.01 J9.2
N$30
  Bottom 0.305: J16.3 12.96,36.95 12.12,37.8 12.12,44.04 13.36,45.29 61.49,45.29 65.61,49.4 158.17,49.4 161.06,52.3 161.06,55.19 159.23,57.02 156.32,57.02 J17.2
N$31
  Bottom 0.305: J24.3 13.1,56.95 11.76,58.29 11.76,67.77 13.56,69.57 60.48,69.57 64.92,74.02 68.28,74.02 70.38,71.91 158.17,71.91 160.2,73.94 160.2,76.1 159.26,77.04 156.3,77.04 J25.2
N$32
  Top 0.305: C7.1 64.34,124.73 R7.2 66.53,124.75 U2.4
N$33
  Bottom 0.305: J34.2 J33.3
N$34
  Bottom 0.305: J35.2 J34.3
N$35
  Bottom 0.305: J36.2 J35.3
N$36
  Bottom 0.305: J38.2 J37.3
N$37
  Bottom 0.305: J39.2 36.32,96.98 J38.3
N$38
  Bottom 0.305: J40.2 16.29,97.03 J39.3
N$39
  Top 0.305: J36.3 93.7,96.98 J37.2
  Bottom 0.305: J37.2 76.28,97
N$40
  Top 0.305: J42.2 136.3,116.96 J41.3
N$41
  Top 0.305: J43.2 116.3,116.98 J42.3
N$42
  Top 0.305: J44.2 J43.3
N$43
  Bottom 0.305: J46.2 56.27,116.98 J45.3
N$44
  Top 0.305: J47.2 J46.3
N$45
  Bottom 0.305: J48.2 J47.3
N$46
  Bottom 0.305: J45.2 76.31,116.96 J44.3
N$47
  Top 0.305: J50.2 136.3,136.99 J49.3
N$48
  Top 0.305: J51.2 116.27,136.97 J50.3
N$49
  Top 0.305: J52.2 96.31,136.94 J51.3
N$50
  Top 0.305: J54.2 56.3,137.01 J53.3
N$51
  Top 0.305: J55.2 J54.3
N$52
  Top 0.305: J56.2 16.29,136.97 J55.3
N$53
  Top 0.305: J53.2 76.36,136.97 J52.3
N$54
  Top 0.305: J58.2 J57.3
N$55
  Top 0.305: J59.2 116.3,156.97 J58.3
N$56
  Top 0.305: J60.2 96.27,157 J59.3
N$57
  Top 0.305: J62.2 J61.3
N$58
  Top 0.305: J63.2 36.3,156.97 J62.3
N$59
  Top 0.305: J64.2 16.27,157 J63.3
N$60
  Top 0.305: J61.2 76.31,157.02 J60.3
N$61
  Bottom 0.305: J40.3 12.57,96.98 11.58,97.97 11.58,101.07 11.94,101.42 77.14,101.42 88.37,112.65 159.61,112.65 160.71,113.74 160.71,115.49 160.76,115.55 159.31,116.99 156.27,116.99 J41.2
N$62
  Bottom 0.305: J48.3 12.96,116.96 12.01,117.91 12.01,129.79 13.66,131.44 158.55,131.44 160.5,133.4 160.5,136.17 159.72,136.96 156.29,136.96 J49.2
N$63
  Bottom 0.305: J56.3 12.36,136.99 11.07,138.28 11.07,146.91 12.14,147.98 158.8,147.98 161.72,150.9 161.72,154.74 159.49,156.97 J57.2
N$64
  Bottom 0.305: J32.3 13.48,77 12.14,78.33 12.14,83.74 13.77,85.37 111.71,85.37 116,89.66 158.09,89.66 160.91,92.48 160.91,95.38 159.23,97.05 156.31,97.05 J33.2
N$65
  Top 0.305: 158.85,45.34 158.85,46.69 R4.1 159.94,46.71 160.4,47.17 160.4,49.28 159,50.67 137.69,50.67 134.16,47.14 R3.2
  Top 0.406: Q4.1 152.83,44.09 153.49,43.43 158.27,43.43 158.9,44.07 158.9,46.69 R4.1
  Top 1.27: R3.2 127.1,49 Q2.2
N$66
  Top 0.305: R17.1 66.95,130.02 66.95,127.77 U2.3 R10.2 64.34,126.29 R7.1
N$67
  Top 0.305: R4.2 R5.1 156.67,48.36 Q4.3
  Top 0.406: Q2.1 122.54,49.24 126.75,45.03 133.78,45.03 138.15,49.4 152.68,49.4 Q4.3
N$68
  Top 0.305: Q3.1 74.56,127.77 C5.1 75.83,128.19 R9.2
N$69
  Top 0.305: U2.1 68.84,130.01 R17.2 71.86,130.2 R8.2
N$70  (via drill 0.38)
  Top 0.305: R8.1 72.23,128.16 71.89,127.83 71.42,127.83 | 71.42,127.83 71.42,124.08 72.08,123.42 73.66,123.42 Q3.3 | C6.2 79.45,129.79 v78.18,129.79 | v70.89,127.94 71.01,127.83 71.42,127.83
  Bottom 0.305: v78.18,129.79 72.39,129.79 70.89,128.29 v70.89,127.94
N$71
  Top 0.305: JP1.6 123.42,17.65 117.37,23.7 R15.1 107.14,25.6 R14.2
N$72
  Top 0.305: C6.1 | C6.1 R13.1 | C6.1 84.21,128.26 M1.IN
N$75
  Top 0.305: 64.62,107.34 63.55,107.34
N$76
  Top 0.305: 64.62,108.66 63.65,108.66
N$77
  Top 0.305: 64.59,109.3 63.68,109.3
N$78
  Top 0.305: 68.1,107.37 69.01,107.37
N$79
  Top 0.305: 68.1,108.66 69.09,108.66
N$80
  Top 0.305: 65.35,110.08 65.35,110.77
N$81
  Top 0.305: 67.33,110.08 67.33,110.77
SOUND  (via drill 0.38)
  Top 0.305: R12.2 59.67,129.36 60.45,129.36 62.04,127.78 R11.1 62.37,126.26 C7.2 61.61,126.25 61.14,125.78 61.14,114.15 58.8,111.81 58.8,107.82 60.73,105.89 60.73,99.75 62.89,97.59 62.89,53.59 v61.92,52.63 | 69.17,52.4 A1.A0 69.68,52.7 70.64,51.74 106.5,51.74 109.04,49.2 109.04,33.45 112.12,30.38 121.26,30.38 123.85,27.79 126.08,27.79 JP1.10 126.01,27.91
  Bottom 0.305: v61.92,52.63 69.09,52.63 A1.A0
SWITCH  (via drill 0.38)
  Top 0.305: v128.55,14.63 129.18,15.27 v129.18,17.75
  Top 0.406: S1.2 v84.99,9.83 84.99,16.26 87.53,18.8 87.53,23.9 | 87.53,23.9 R6.2 | 87.53,23.9 34.7,23.9 25.25,33.35 25.25,52.91 22.92,55.24 A1.D4
  Bottom 0.305: v84.99,9.83 120.57,9.83 124.59,13.84 127.23,13.84 128.02,14.63 v128.55,14.63 | v129.18,17.75 129.16,17.78 129.16,24.26 132.72,27.82 JP2.10
V+  (via drill 0.38, 0.6)
  Top 0.305: v72.49,62.92 72.82,62.92 72.85,62.89
  Top 0.61: J4.1 96.44,19.7 96.44,21.34 | 96.44,21.34 95.91,21.87 95.86,21.87 | 91.08,21.64 90.19,20.75 90.19,19.41 | 96.44,21.34 96.39,21.34 95.86,21.87 | 95.86,21.87 91.31,21.87 91.08,21.64 | 91.08,21.64 91.06,21.64 90.17,20.75 v90.17,19.33
  Top 0.813: 96.44,21.34 98.73,21.34 100.1,19.96 100.1,11.51 v100.13,11.48 | v110.85,11.86 111.78,11.86
  Top 2.184: 124.64,74.55 124.61,74.55 124.61,63.93 124.74,63.93 124.74,68.53 129.41,68.53 129.41,68.5 119.89,68.5
  Bottom 0.305: A1.A4 72.44,62.86 v72.49,62.92
  Bottom 0.61: J45.1 88.41,119.52 90.53,121.64 95.53,121.64 96.37,120.8 96.37,119.6 J44.1 | v90.17,19.33 76.43,19.33 J5.1
  Bottom 0.813: v100.13,11.48 109.19,11.48 109.58,11.86 v110.85,11.86
  Bottom 1.016: SV1.1 21.22,107.71 SV1.P$1
  other vias: 109.47,11.71 101.17,11.48 89,19.33 84.81,19.33 83.41,19.33
  pour Top (isolate 0.305): 0.64,169.54 169.54,169.54 169.54,0.64 0.64,0.64
XOUT  (via drill 0.38)
  Top 0.305: C11.2 71.28,109.31 U1.X 69.97,109.31 v70,109.27 | A1.A1 67.58,55.24 66.9,54.56 66.9,51.82 67.64,51.08 106.15,51.08 108.33,48.9 108.33,33.02 111.63,29.72 120.04,29.72 124.54,25.22 126.06,25.22 JP1.9 | v68.07,104.22 64.57,100.71 64.57,60.48 v65.08,59.97
  Bottom 0.305: v70,109.27 69.85,109.27 69.16,108.58 69.16,105.31 v68.07,104.22 | v65.08,59.97 65.08,56.97 66.7,55.35 69.06,55.35 A1.A1
YOUT  (via drill 0.38)
  Top 0.305: U1.Y 71.27,108.01 C10.2 69.95,107.9 v69.93,107.92 | JP1.8 126.08,22.76 124.64,22.76 118.47,28.93 111.33,28.93 107.67,32.59 107.67,48.41 105.72,50.37 67.41,50.37 66.24,51.54 66.24,56.06 67.97,57.78 A1.A2 | v69.09,104.14 65.33,100.38 65.33,61.19 v65.91,60.6
  Bottom 0.305: v69.93,107.92 69.93,104.98 v69.09,104.14 | A1.A2 66.62,57.78 65.91,58.5 v65.91,60.6
ZOUT
  Top 0.305: C9.2 71.37,105.28 71.07,104.98 | 71.07,104.98 67.59,104.98 67.33,105.23 67.33,106.56 U1.Z | 67.92,60.32 A1.A3 67.41,60.32 | JP1.7 126.03,20.12 124.89,20.12 116.76,28.25 110.97,28.25 107.04,32.18 107.04,48.18 105.41,49.81 67.06,49.81 65.51,51.36 65.51,58.59 67.24,60.32 67.41,60.32 | 71.07,104.98 71.09,104.98 71.37,105.26 71.37,105.13 65.94,99.69 65.94,61.79 67.41,60.32

### Text on the board
bPlace: www.L3Dcube.com | Rev 0.7 | Nov 04 2014 | +5V | DIN | GND | Arduino | Join WiFi | Network | Spark Core | Offline/Online